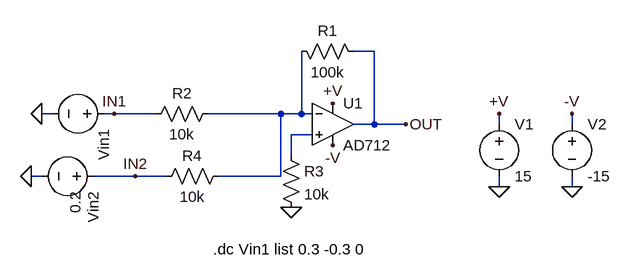
[diagram p0: schematic InvertingSummingAmplifier.asc]
* InvertingSummingAmplifier.asc
Vin1 IN1 0
* U1: AD712 (symbol AD712 not available, pins judged from their places): In+=N002 In-=N001 V+=+V V-=-V OUT=OUT
R1 N001 OUT 100k
R2 N001 IN1 10k
R3 N002 0 10k
V1 +V 0 15
V2 -V 0 -15
R4 N001 IN2 10k
Vin2 IN2 0 0.2
.dc Vin1 list 0.3 -0.3 0
.backanno
.end

* Results of the author's LTspice run, read from the files saved beside the schematic
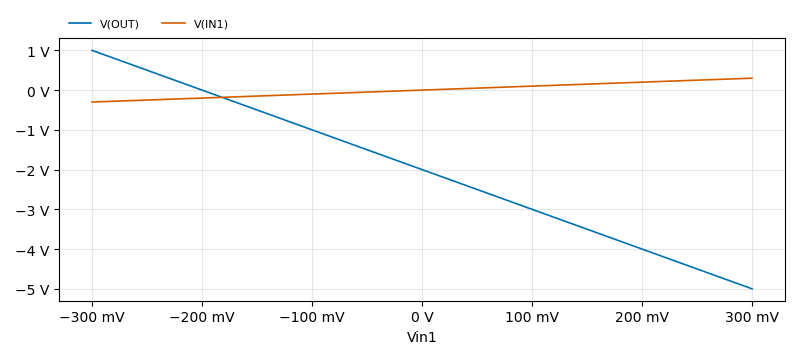
[diagram p1: DC transfer characteristic of InvertingSummingAmplifier.asc, plotted from the saved traces]
* DC transfer characteristic, 1 run:
*   V(OUT): 1 V at Vin1=-300 mV, -5 V at Vin1=300 mV, min -5 V, max 1 V
*   V(IN1): -300 mV at Vin1=-300 mV, 300 mV at Vin1=300 mV, min -300 mV, max 300 mV